# Altium project M66-v2.PrjPcb
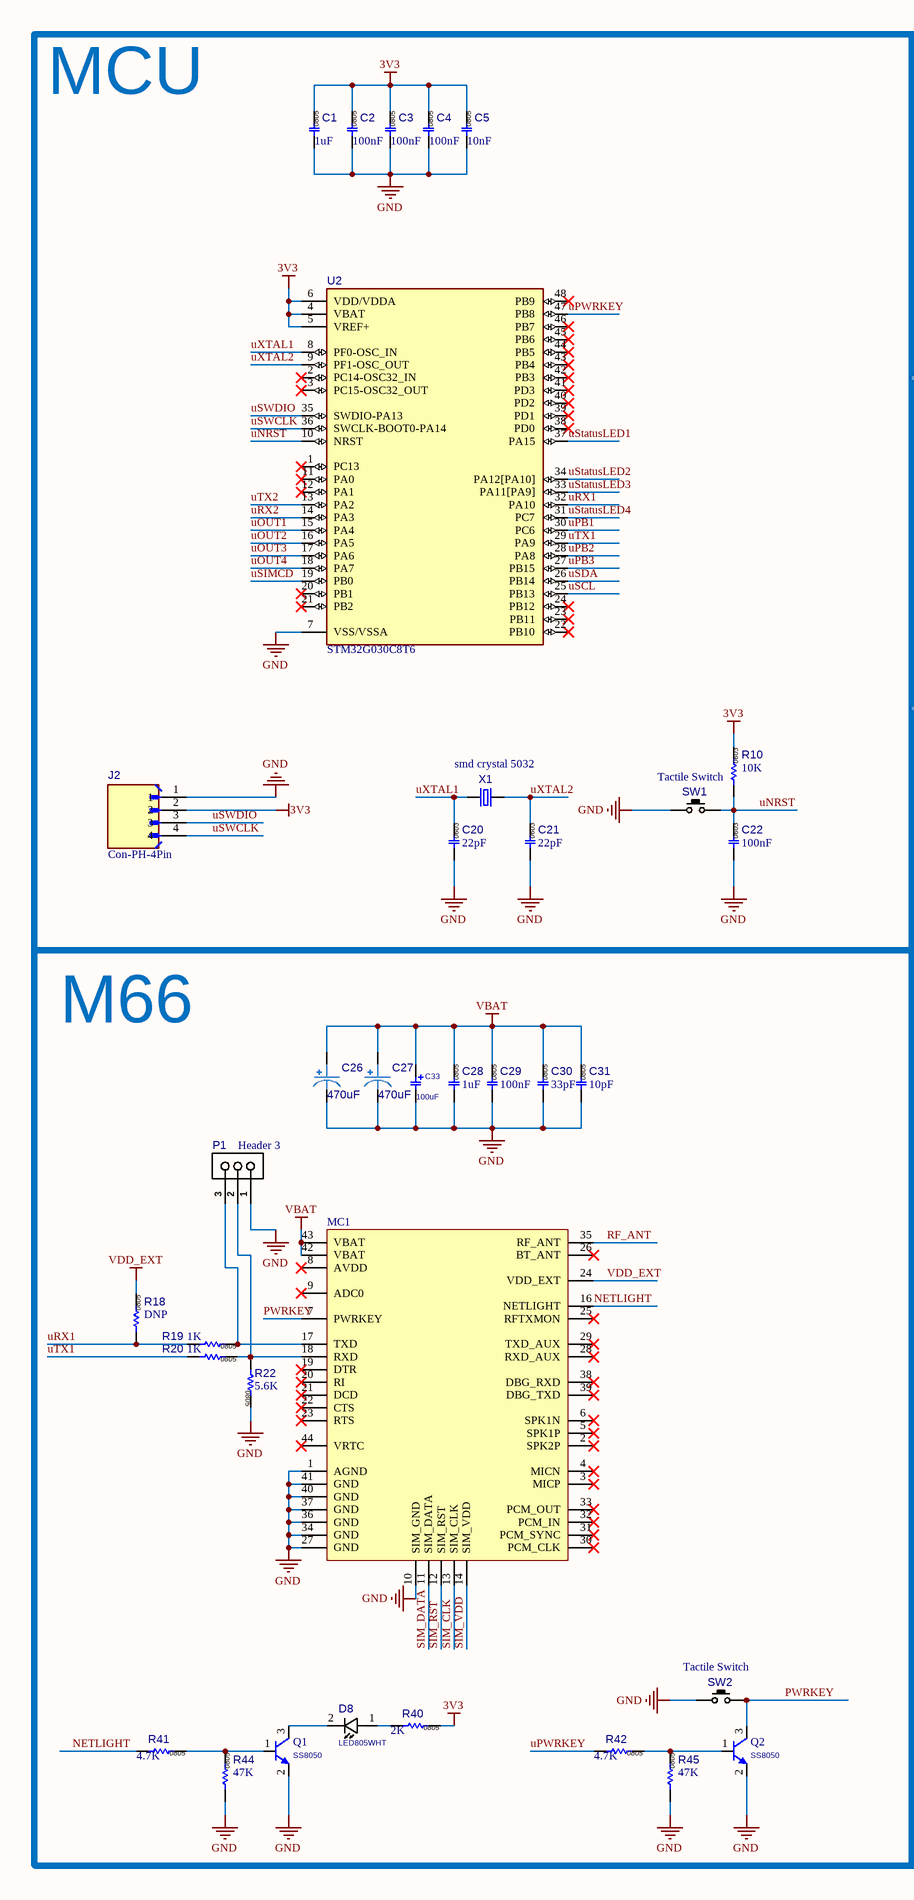
[diagram p0: M66v2SCH.SchDoc, left]
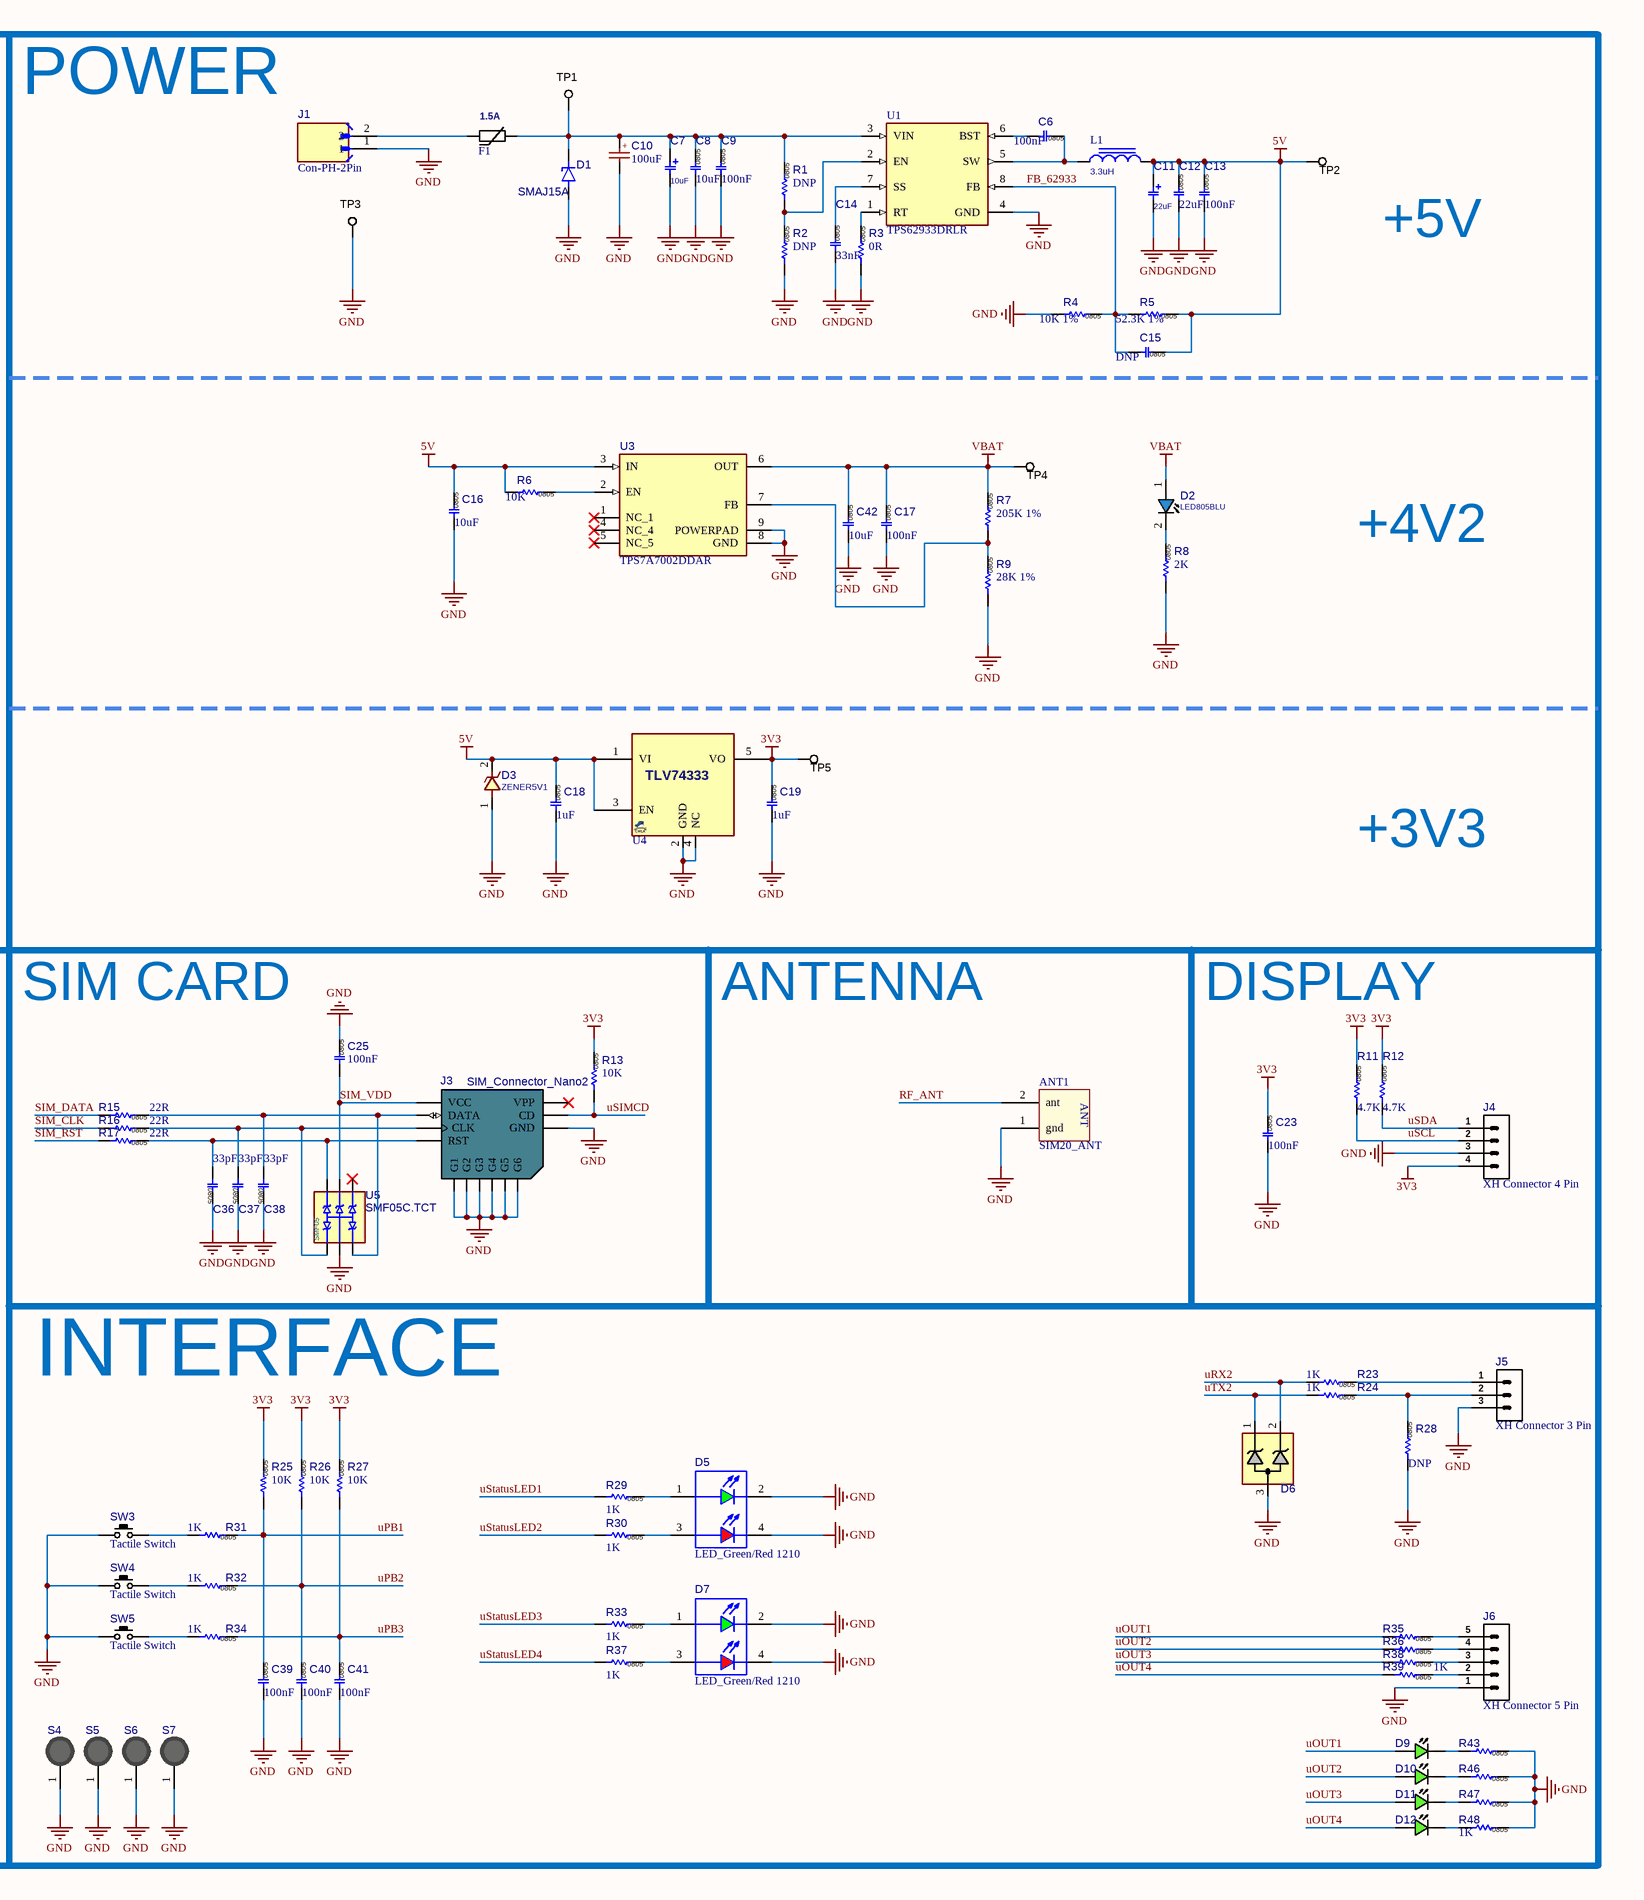
[diagram p1: M66v2SCH.SchDoc, right]
1 sheet, 128 parts. Net scope: global (net labels, ports and power ports of the same name join across sheets).
Board file: M66v2PCB.PcbDoc

## Sheet M66v2SCH.SchDoc
size C; SheetNumber: 1; SheetTotal: 1

### Parts
ANT1  SIM20_ANT  [MY_SIM20_ANT]
C1  1uF  [Cap SMD 0805]
C2  100nF  [Cap SMD 0805]
C3  100nF  [Cap SMD 0805]
C4  100nF  [Cap SMD 0805]
C5  10nF  [Cap SMD 0805]
C6  100nF  [Cap SMD 0805]
C7  10uF  [C_TN_3216]
C8  10uF  [Cap SMD 0805]
C9  100nF  [Cap SMD 0805]
C10  100uF  [Cap SMD 6.3x5.4mm]
C11  22uF  [C_TN_3216]
C12  22uF  [Cap SMD 0805]
C13  100nF  [Cap SMD 0805]
C14  33nF  [Cap SMD 0805]
C15  DNP  [Cap SMD 0805]
C16  10uF  [Cap SMD 0805]
C17  100nF  [Cap SMD 0805]
C18  1uF  [Cap SMD 0805]
C19  1uF  [Cap SMD 0805]
C20  22pF  [Cap SMD 0603]
C21  22pF  [Cap SMD 0603]
C22  100nF  [Cap SMD 0603]
C23  100nF  [Cap SMD 0805]
C25  100nF  [Cap SMD 0805]
C26  470uF  [Solid Capacitor 6.3x8mm]
C27  470uF  [Solid Capacitor 6.3x8mm]
C28  1uF  [Cap SMD 0805]
C29  100nF  [Cap SMD 0805]
C30  33pF  [Cap SMD 0805]
C31  10pF  [Cap SMD 0805]
C33  100uF  [C_TN_3528_BLK]
C36  33pF  [Cap SMD 0805]
C37  33pF  [Cap SMD 0805]
C38  33pF  [Cap SMD 0805]
C39  100nF  [Cap SMD 0805]
C40  100nF  [Cap SMD 0805]
C41  100nF  [Cap SMD 0805]
C42  10uF  [Cap SMD 0805]
D1  SMAJ15A  [SMAJ15A]
D2  LED805BLU  [LED0805BLU]
D3  ZENER5V1  [D_SOD123W]
D5  LED_Green/Red 1210  [LED_Green/Red 1210]
D6  PESD3V3S2UT  [PESD3V3S2UT]  (value not drawn)
D7  LED_Green/Red 1210  [LED_Green/Red 1210]
D8  LED805WHT  [LED0805WHT]
D9  LED805GRN  [LED0805GRN]  (value not drawn)
D10  LED805GRN  [LED0805GRN]  (value not drawn)
D11  LED805GRN  [LED0805GRN]  (value not drawn)
D12  LED805GRN  [LED0805GRN]  (value not drawn)
F1  1.5A  [FUSE1206 (3216)]
J1  Con-PH-2Pin  [Con-PH-2Pin-ST]
J2  Con-PH-4Pin  [Con-PH-4Pin-ST]
J3  SIM_Connector_Nano2  [SIM_Connector_Nano2]
J4  XH Connector 4 Pin  [XH 4 Pin - 2.5mm]
J5  XH Connector 3 Pin  [XH 3 Pin - 2.5mm]
J6  XH Connector 5 Pin  [XH 5 Pin - 2.5mm]
L1  3.3uH  [SMD Inductor 3]
MC1  M66  [m66]  (value not drawn)
P1  Header 3  [HDR 1X3 Male Top]
Q1  SS8050  [SOT23_3]
Q2  SS8050  [SOT23_3]
R1  DNP  [Res SMD 0805]
R2  DNP  [Res SMD 0805]
R3  0R  [Res SMD 0805]
R4  10K 1%  [Res SMD 0805]
R5  52.3K 1%  [Res SMD 0805]
R6  10K  [Res SMD 0805]
R7  205K 1%  [Res SMD 0805]
R8  2K  [Res SMD 0805]
R9  28K 1%  [Res SMD 0805]
R10  10K  [Res SMD 0603]
R11  4.7K  [Res SMD 0805]
R12  4.7K  [Res SMD 0805]
R13  10K  [Res SMD 0805]
R15  22R  [Res SMD 0805]
R16  22R  [Res SMD 0805]
R17  22R  [Res SMD 0805]
R18  DNP  [Res SMD 0805]
R19  1K  [Res SMD 0805]
R20  1K  [Res SMD 0805]
R22  5.6K  [Res SMD 0805]
R23  1K  [Res SMD 0805]
R24  1K  [Res SMD 0805]
R25  10K  [Res SMD 0805]
R26  10K  [Res SMD 0805]
R27  10K  [Res SMD 0805]
R28  DNP  [Res SMD 0805]
R29  1K  [Res SMD 0805]
R30  1K  [Res SMD 0805]
R31  1K  [Res SMD 0805]
R32  1K  [Res SMD 0805]
R33  1K  [Res SMD 0805]
R34  1K  [Res SMD 0805]
R35  1K  [Res SMD 0805]  (value not drawn)
R36  1K  [Res SMD 0805]  (value not drawn)
R37  1K  [Res SMD 0805]
R38  1K  [Res SMD 0805]  (value not drawn)
R39  1K  [Res SMD 0805]
R40  2K  [Res SMD 0805]
R41  4.7K  [Res SMD 0805]
R42  4.7K  [Res SMD 0805]
R43  1K  [Res SMD 0805]  (value not drawn)
R44  47K  [Res SMD 0805]
R45  47K  [Res SMD 0805]
R46  1K  [Res SMD 0805]  (value not drawn)
R47  1K  [Res SMD 0805]  (value not drawn)
R48  1K  [Res SMD 0805]
S4  Screw 1  [Screw 1]  (value not drawn)
S5  Screw 1  [Screw 1]  (value not drawn)
S6  Screw 1  [Screw 1]  (value not drawn)
S7  Screw 1  [Screw 1]  (value not drawn)
SW1  Tactile Switch  [Tactil Switch 3*4*2]
SW2  Tactile Switch  [Tactile Switch 3*6*5]
SW3  Tactile Switch  [Tactile Switch 6*6 - 2Pin]
SW4  Tactile Switch  [Tactile Switch 6*6 - 2Pin]
SW5  Tactile Switch  [Tactile Switch 6*6 - 2Pin]
TP1  TESTPOINT_SMD  [TPSMD_S1]  (value not drawn)  (no BOM)
TP2  TESTPOINT_SMD  [TPSMD_S1]  (value not drawn)  (no BOM)
TP3  TESTPOINT_SMD  [TPSMD_S1]  (value not drawn)  (no BOM)
TP4  TESTPOINT_SMD  [TPSMD_S1]  (value not drawn)  (no BOM)
TP5  TESTPOINT_SMD  [TPSMD_S1]  (value not drawn)  (no BOM)
U1  TPS62933DRLR  [TPS62933DRLR]
U2  STM32G030C8T6  [STM32G030C8T6]
U3  TPS7A7002DDAR  [TPS7A7002DDAR]
U4  TLV74333  [SOT23_5]  (value not drawn)
U5  SMF05C.TCT  [SMF05C.TCT]
X1  smd crystal 5032  [smd crystal 5032]

### Nets
3V3: C1.2 C2.2 C3.2 C4.2 C5.2 C19.2 C23.2 J2.2 J4.4 R10.2 R11.2 R12.2 R13.2 R25.2 R26.2 R27.2 R40.2 TP5.1 U2.4(VBAT) U2.5(VREF+) U2.6(VDD/VDDA) U4.5(VO)
5V: C11.1 C12.2 C13.2 C15.2 C16.2 C18.2 D3.2 L1.2 R5.2 R6.1 TP2.1 U3.3(IN) U4.1(VI) U4.3(EN)
GND: ANT1.1(gnd) C1.1 C2.1 C3.1 C4.1 C5.1 C7.2 C8.1 C9.1 C10.2(-) C11.2 C12.1 C13.1 C14.1 C16.1 C17.1 C18.1 C19.1 C20.1 C21.1 C22.1 C23.1 C25.2 C26.2(N) C27.2(N) C28.1 C29.1 C30.1 C31.1 C33.2 C36.2 C37.2 C38.2 C39.1 C40.1 C41.1 C42.1 D1.A D3.1 D5.2(RED_K) D5.4(BLUE_K) D6.3(GND) D7.2(RED_K) D7.4(BLUE_K) J1.1 J2.1 J3.C5(GND) J3.G1 J3.G2 J3.G3 J3.G4 J3.G5 J3.G6 J4.3 J5.3 J6.1 MC1.1(AGND) MC1.10(SIM_GND) MC1.27(GND) MC1.34(GND) MC1.36(GND) MC1.37(GND) MC1.40(GND) MC1.41(GND) P1.1 Q1.2(E) Q2.2(E) R2.1 R3.1 R4.1 R8.1 R9.1 R22.2 R28.1 R43.2 R44.1 R45.1 R46.2 R47.2 R48.2 S4.1 S5.1 S6.1 S7.1 SW1.1(P1) SW2.1(P1) SW3.1(P1) SW4.1(P1) SW5.1(P1) TP3.1 U1.4(GND) U2.7(VSS/VSSA) U3.8(GND) U3.9(POWERPAD) U4.2(GND) U4.4(NC) U5.2(A)
VBAT: C17.2 C26.1(P) C27.1(P) C28.2 C29.2 C30.2 C31.2 C33.1 C42.2 D2.1(ANODE) MC1.42(VBAT) MC1.43(VBAT) R7.2 TP4.1 U3.6(OUT)
VDD_EXT: MC1.24(VDD_EXT) R18.2
FB_62933: C15.1 R4.2 R5.1 U1.8(FB)
NETLIGHT: MC1.16(NETLIGHT) R41.1
PWRKEY: MC1.7(PWRKEY) Q2.3(C) SW2.2(P3)
RF_ANT: ANT1.2(ant) MC1.35(RF_ANT)
SIM_CLK: MC1.13(SIM_CLK) R16.1
SIM_DATA: MC1.11(SIM_DATA) R15.1
SIM_RST: MC1.12(SIM_RST) R17.1
SIM_VDD: C25.1 J3.C1(VCC) MC1.14(SIM_VDD) U5.5(C4)
uNRST: C22.2 R10.1 SW1.2(P3) U2.10(NRST)
uOUT1: D9.1(ANODE) R35.1 U2.15(PA4)
uOUT2: D10.1(ANODE) R36.1 U2.16(PA5)
uOUT3: D11.1(ANODE) R38.1 U2.17(PA6)
uOUT4: D12.1(ANODE) R39.1 U2.18(PA7)
uPB1: C39.2 R25.1 R31.2 U2.30(PC6)
uPB2: C40.2 R26.1 R32.2 U2.28(PA8)
uPB3: C41.2 R27.1 R34.2 U2.27(PB15)
uPWRKEY: R42.1 U2.47(PB8)
uRX1: R18.1 R19.1 U2.32(PA10)
uRX2: D6.2(IO2) R23.1 U2.14(PA3)
uSCL: J4.2 R11.1 U2.25(PB13)
uSDA: J4.1 R12.1 U2.26(PB14)
uSIMCD: J3.CD R13.1 U2.19(PB0)
uStatusLED1: R29.1 U2.37(PA15)
uStatusLED2: R30.1 U2.34(PA12[PA10])
uStatusLED3: R33.1 U2.33(PA11[PA9])
uStatusLED4: R37.1 U2.31(PC7)
uSWCLK: J2.4 U2.36(SWCLK-BOOT0-PA14)
uSWDIO: J2.3 U2.35(SWDIO-PA13)
uTX1: R20.1 U2.29(PA9)
uTX2: D6.1(IO1) R24.1 U2.13(PA2)
uXTAL1: C20.2 U2.8(PF0-OSC_IN) X1.1
uXTAL2: C21.2 U2.9(PF1-OSC_OUT) X1.2
NetC6_1: C6.1 U1.6(BST)
NetC6_2: C6.2 L1.1 U1.5(SW)
NetC7_1: C7.1 C8.2 C9.2 C10.1(+) D1.C F1.2 R1.2 TP1.1 U1.3(VIN)
NetC14_2: C14.2 U1.7(SS)
NetC36_1: C36.1 J3.C2(RST) R17.2 U5.6(C5)
NetC37_1: C37.1 J3.C3(CLK) R16.2 U5.1(C1)
NetC38_1: C38.1 J3.C7(DATA) R15.2 U5.3(C2)
NetD2_2: D2.2(CATHODE) R8.2
NetD5_1: D5.1(A) R29.2
NetD5_3: D5.3(GREEN_K) R30.2
NetD7_1: D7.1(A) R33.2
NetD7_3: D7.3(GREEN_K) R37.2
NetD8_1: D8.1(ANODE) R40.1
NetD8_2: D8.2(CATHODE) Q1.3(C)
NetD9_2: D9.2(CATHODE) R43.1
NetD10_2: D10.2(CATHODE) R46.1
NetD11_2: D11.2(CATHODE) R47.1
NetD12_2: D12.2(CATHODE) R48.1
NetF1_1: F1.1 J1.2
NetJ5_1: J5.1 R23.2
NetJ5_2: J5.2 R24.2 R28.2
NetJ6_2: J6.2 R39.2
NetJ6_3: J6.3 R38.2
NetJ6_4: J6.4 R36.2
NetJ6_5: J6.5 R35.2
NetMC1_17: MC1.17(TXD) P1.3 R19.2
NetMC1_18: MC1.18(RXD) P1.2 R20.2 R22.1
NetQ1_1: Q1.1(B) R41.2 R44.2
NetQ2_1: Q2.1(B) R42.2 R45.2
NetR1_1: R1.1 R2.2 U1.2(EN)
NetR3_2: R3.2 U1.1(RT)
NetR6_2: R6.2 U3.2(EN)
NetR7_1: R7.1 R9.2 U3.7(FB)
NetR31_1: R31.1 SW3.2(P3)
NetR32_1: R32.1 SW4.2(P3)
NetR34_1: R34.1 SW5.2(P3)

Not connected (* = marked no-connect by the designer): J3 C6(VPP)*; MC1 2(SPK2P)* 3(MICP)* 4(MICN)* 5(SPK1P)* 6(SPK1N)* 8(AVDD)* 9(ADC0)* 19(DTR)* 20(RI)* 21(DCD)* 22(CTS)* 23(RTS)* 25(RFTXMON)* 26(BT_ANT)* 28(RXD_AUX)* 29(TXD_AUX)* 30(PCM_CLK)* 31(PCM_SYNC)* 32(PCM_IN)* 33(PCM_OUT)* 38(DBG_RXD)* 39(DBG_TXD)* 44(VRTC)*; U2 1(PC13)* 2(PC14-OSC32_IN)* 3(PC15-OSC32_OUT)* 11(PA0)* 12(PA1)* 20(PB1)* 21(PB2)* 22(PB10)* 23(PB11)* 24(PB12)* 38(PD0)* 39(PD1)* 40(PD2)* 41(PD3)* 42(PB3)* 43(PB4)* 44(PB5)* 45(PB6)* 46(PB7)* 48(PB9)*; U3 1(NC_1)* 4(NC_4)* 5(NC_5)*; U5 4(C3)*

### Notes on the sheet
- MCU
- POWER
- +5V
- +4V2
- +3V3
- M66
- SIM CARD
- ANTENNA
- DISPLAY
- INTERFACE
- (in symbol Cap SMD 0603) 0603
- (in symbol Cap SMD 0805) 0805
- (in symbol Res SMD 0603) 0603
- (in symbol Res SMD 0805) 0805
- (in symbol SMF05C.TCT) SMF05

### Library data of the parts
ANT1 = SIM20_ANT: ANT
C1-C6 C9 C13-C15 C17 C23 C25 C28-C31 C36-C42 = Cap SMD 0805
  C1 C28: VALUE: 1uF
  C2-C4 C6 C9 C13 C17 C23 C25 C29 C39-C41: VALUE: 100nF
  C5: VALUE: 10nF
  C14: VALUE: 33nF
  C15: VALUE: DNP
  C30 C36-C38: VALUE: 33pF
  C31: VALUE: 10pF
  C42: VALUE: 10uF
C7 C11 = CAP_SMD_TAN_3216: CAP, SMD, TAN,; PARAM2: -V
  C7: VALUE: 10uF
  C11: VALUE: 22uF
C8 C12 C16 C18 C19 = Cap SMD 0805: VALUE: 100nF
C10 = CAP Electrolytic SMD: SMD Aluminum Electrolytic Capacitor; Desc: SMD Aluminum Electrolytic Capacitors; Voltage: 12v; Tolerance: 5%; Value: 100uF; Library Link: https://github.com/Majid-Derhambakhsh; Publisher: Majid Derhambakhsh
C20-C22 = Cap SMD 0603
  C20 C21: VALUE: 22pF
  C22: VALUE: 100nF
C26 C27 = CAP Solid: Solid Polymer Electrolytic Capacitor; VALUE: 470uF
C33 = CAP_SMD_TAN_4: CAP, SMD, TAN; PARAM: 20%, 300mOhm, -55~105oC; MANF: VISHAY; MANF_P#: T55A106M6R3C0300; PARAM2: 6.3V; PRICE: 0.46$; VALUE: 100uF
D1 = SMAJ15A: TVS Diode Uni-directional 15V SMA  BR Voltage : 16.7V  Clamping Volatage : 24.4V
D2 = LED_SMD_0805_BLU: LED, SMD, 0805, BLUE; DESC: DESCRIPTION; MANF_P#: MANF_PART#; PARAM2: 2.2V; MANF: MANF; ASSEMBLY: ASSEMBLY; PRICE: 36t@Javan; VALUE: LED805BLU
D3 = DIODE_SMD_ZENER_BZT52HC5V1: DIODE, ZENER, 1W, 5.1V; MANF: Diodes; DESC: DESCRIPTION; PARAM2: 1W, 4Ohm, -55~150oC; MANF_P#: BZT52HC5V1WF-7; ASSEMBLY: ASSEMBLY; PRICE: 0.25$; PARAM: 5.1V; VALUE: ZENER5V1
D5 D7 = LED_Green/Red 1210: Red, Green, Blue (RGB) 626nm Red, 525nm Green, 470nm Blue LED Indication - Discrete 1.9V Red, 3.5V Green, 3.5V Blue 1210 (3225 Metric)
D6 = PESD3V3S2UT: Uni-directional Double ESD Protection Diode. Working Voltage:3.3 , Breakdown Voltage:5.6
D8 = LED_SMD_0805_WHT: LED, SMD, 0805, WHITE; DESC: DESCRIPTION; MANF_P#: MANF_PART#; PARAM2: 2.2V; MANF: MANF; ASSEMBLY: ASSEMBLY; PRICE: 36t@Javan; VALUE: LED805WHT
D9-D12 = LED_SMD_0805_GRN: LED, SMD, 0805, GREEN; PARAM: 20mA; DESC: DESCRIPTION; PARAM2: 2.2V; MANF: -; ASSEMBLY: ASSEMBLY; PRICE: 36t@Javan; MANF_P#: -; VALUE: LED805GRN
F1 = PPTC Resettable Fuses: Value: 1.5A; Publisher: Majid Derhambakhsh
J1 = Con-PH-2Pin: Connector Header Through Hole 2 position 0.079 (2.00mm)
J2 = Con-PH-4Pin: Connector Header Through Hole 4 position 0.079 (2.00mm)
J3 = SIM_Connector_Nano2: Nano Sim Card 6P SMT-Card Detection
J4 = XH 4: XH, 4-Pin; Current: 3A; Library Link: https://github.com/Majid-Derhambakhsh; Publisher: Majid Derhambakhsh
J5 = XH 3: XH, 3-Pin; Current: 3A; Library Link: https://github.com/Majid-Derhambakhsh; Publisher: Majid Derhambakhsh
J6 = XH 5: XH, 5-Pin; Current: 3A; Library Link: https://github.com/Majid-Derhambakhsh; Publisher: Majid Derhambakhsh
L1 = SMD Inductor 3: 1008 (2520 metric) Part Number : DFE252012F-4R7M=P2
MC1 = ModSen_Com_M66: Quectel GSM/GPRS Module; Rating: Rating?; Validation: Valid; Inflow: inflow?; Package: Dip; Value: M66; Type: GSM-GPRS
P1 = Header 3: Header, 3-Pin; Library Link: https://github.com/Majid-Derhambakhsh; Publisher: Majid Derhambakhsh
Q1 Q2 = NPN_SS8050_SOT23: BJT, NPN, 25v, 1.5A, SMD, SOT23; PARAM2: 300mW; MANF: GALAXY; PARAM: 25v, 1.5A; MANF_P#: SS8050; VALUE: SS8050
R1-R9 R11-R13 R15-R20 R22-R48 = Res SMD 0805
  R1 R2 R18 R28: VALUE: DNP
  R3: VALUE: 0R
  R4: VALUE: 10K 1%
  R5: VALUE: 52.3K 1%
  R6 R13 R25-R27: VALUE: 10K
  R7: VALUE: 205K 1%
  R8 R40: VALUE: 2K
  R9: VALUE: 28K 1%
  R11 R12 R41 R42: VALUE: 4.7K
  R15-R17: VALUE: 22R
  R19 R20 R23 R24 R29-R39 R43 R46-R48: VALUE: 1K
  R22: VALUE: 5.6K
  R44 R45: VALUE: 47K
R10 = Res SMD 0603: VALUE: 10K
SW1 = Tactile Switch: 3x6x5 mm - 2 Pin
TP1-TP5 = TESTPOINT_SMD: TEST POINT; MANF: MANF; MANF_P#: MANF_P#; VALUE: VALUE
U1 = TPS62933DRLR: 3.8-V to 30-V, 3-A, 200-kHz to 2.2-MHz, low-IQ synchronous buck converter in SOT-583 package
U2 = STM32G030C8T6: ARMÂ® CortexÂ®-M0+ series Microcontroller IC 32-Bit Single-Core 64MHz 64KB (64K x 8) FLASH 48-LQFP (7x7)
U3 = TPS7A7002DDAR: 3-A, low-VIN (1.4-V), adjustable ultra-low-dropout voltage regulator with enable 8-SO PowerPAD -40 to 125
U4 = VREG_TLV74333_SOT23: REG, Linear, LDO0.12V, Fixed, 300mA, VIN1.4~5.5V, VOUT1~5.5V, SOT-23-5; MANF: Texas Instruments; MANF_P#: TLV74333PDQN; PARAM2: 1.4~5.5Vin, LDO0.12V, Fixed3.0V; PARAM: 300mA, 50dB PSRR, -40~125°C; PRICE: $0.3; VALUE: TLV74333
U5 = SMF05C.TCT: 12.5V Clamp 8A (8/20Âµs) Ipp Tvs Diode Surface Mount SC-88/SC70-6/SOT-363
X1 = smd crystal 5032: 8Mhz - 2Pin - 5032 Package